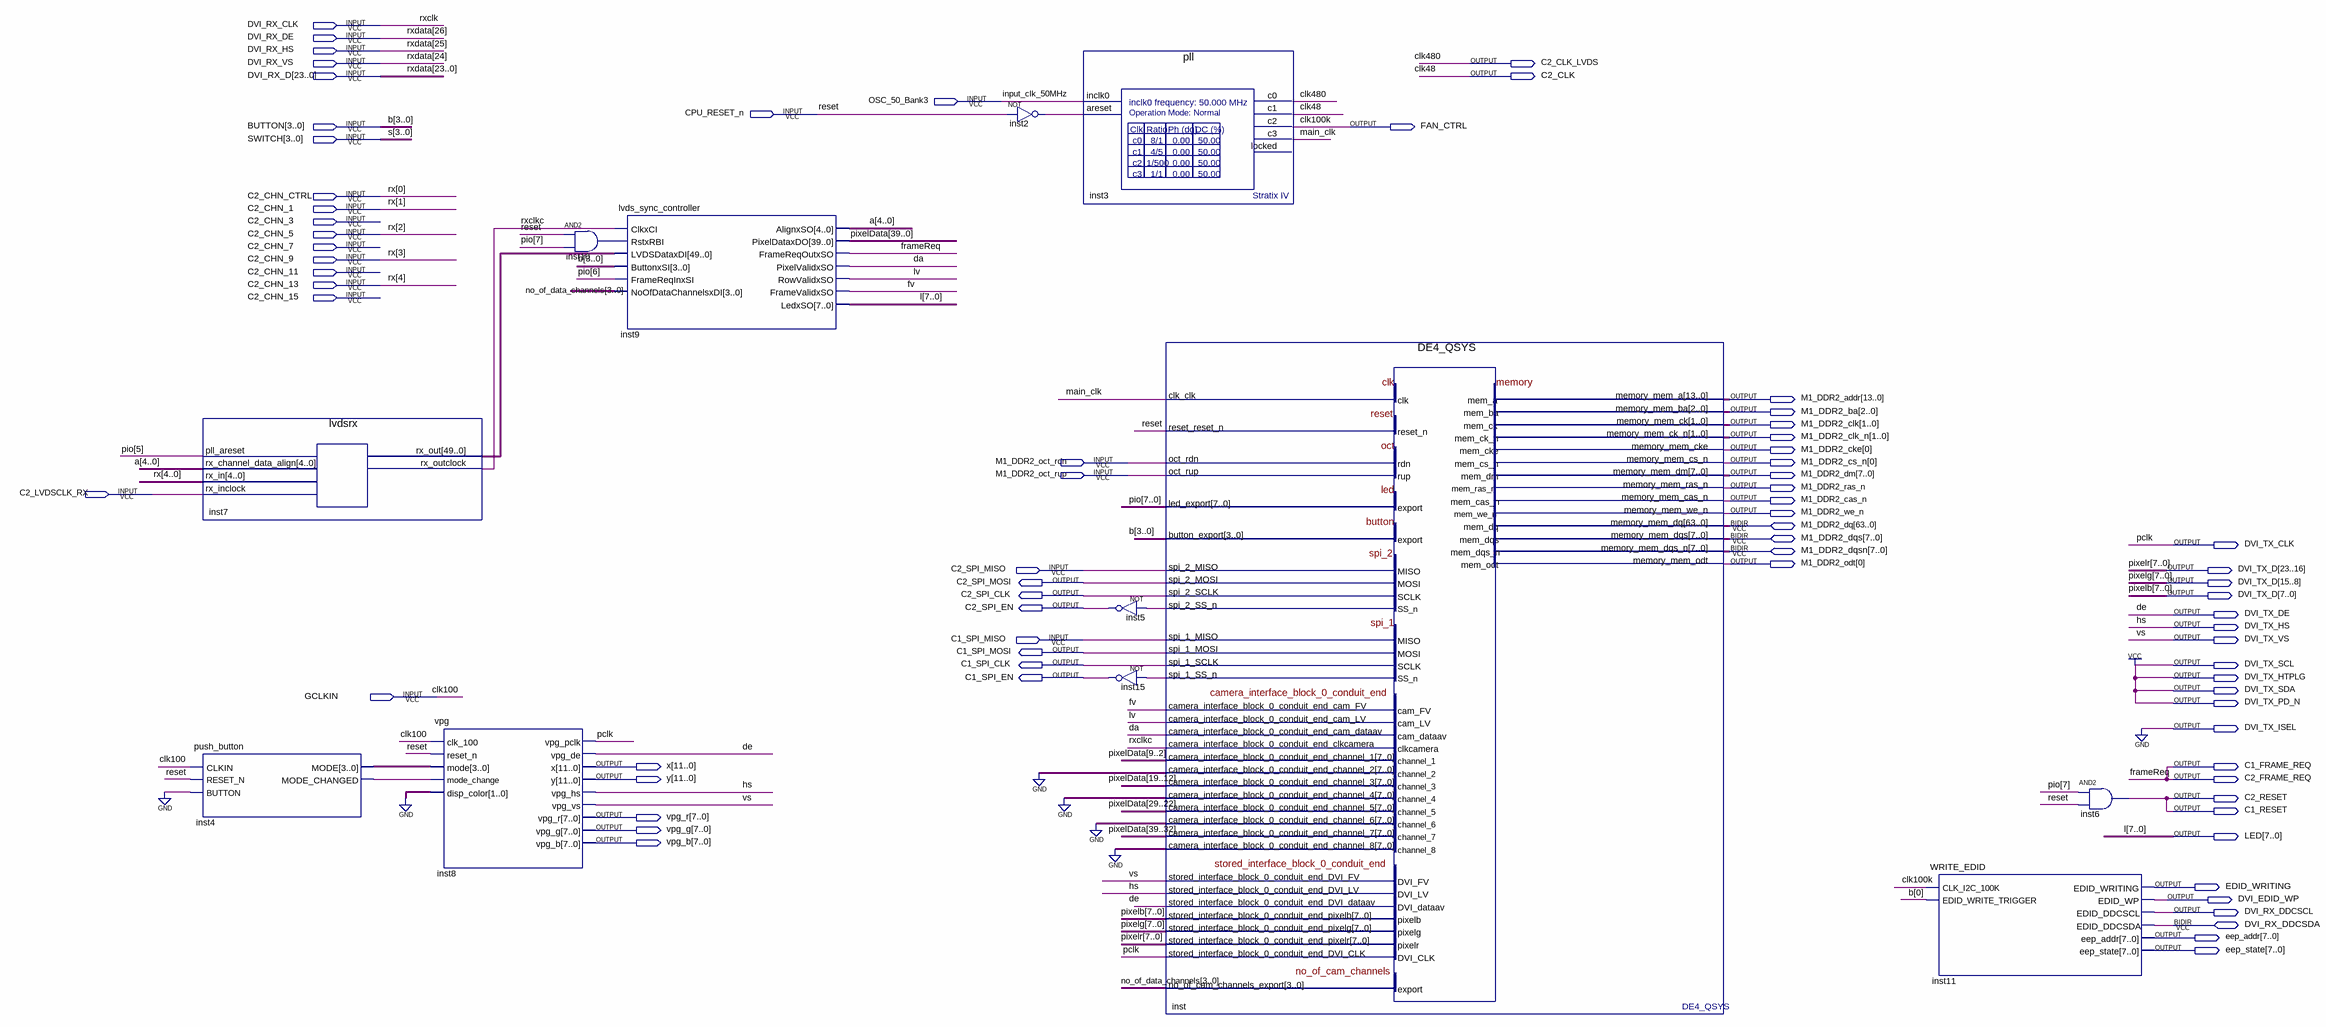
[diagram p0: schematic sheet]
// Quartus schematic cmv4000design.bdf as structural Verilog: 12 symbols, 75 pins
module cmv4000design (
  input  DVI_RX_CLK,
  input  DVI_RX_DE,
  input  DVI_RX_HS,
  input  DVI_RX_VS,
  input  [23:0] DVI_RX_D,
  input  OSC_50_Bank3,
  input  CPU_RESET_n,
  input  [3:0] BUTTON,
  input  [3:0] SWITCH,
  input  C2_CHN_CTRL,
  input  C2_CHN_1,
  input  C2_CHN_3,
  input  C2_CHN_5,
  input  C2_CHN_7,
  input  C2_CHN_9,
  input  C2_CHN_11,
  input  C2_CHN_13,
  input  C2_CHN_15,
  input  M1_DDR2_oct_rdn,
  input  M1_DDR2_oct_rup,
  input  C2_LVDSCLK_RX,
  input  C2_SPI_MISO,
  input  C1_SPI_MISO,
  input  GCLKIN,
  inout  [63:0] M1_DDR2_dq,
  inout  [7:0] M1_DDR2_dqs,
  inout  [7:0] M1_DDR2_dqsn,
  inout  DVI_RX_DDCSDA,
  output C2_CLK_LVDS,
  output C2_CLK,
  output FAN_CTRL,
  output [13:0] M1_DDR2_addr,
  output [2:0] M1_DDR2_ba,
  output [1:0] M1_DDR2_clk,
  output [1:0] M1_DDR2_clk_n,
  output [0:0] M1_DDR2_cke,
  output [0:0] M1_DDR2_cs_n,
  output [7:0] M1_DDR2_dm,
  output M1_DDR2_ras_n,
  output M1_DDR2_cas_n,
  output M1_DDR2_we_n,
  output DVI_TX_CLK,
  output [0:0] M1_DDR2_odt,
  output [23:0] DVI_TX_D,
  output C2_SPI_MOSI,
  output C2_SPI_CLK,
  output C2_SPI_EN,
  output DVI_TX_DE,
  output DVI_TX_HS,
  output DVI_TX_VS,
  output C1_SPI_MOSI,
  output C1_SPI_CLK,
  output DVI_TX_SCL,
  output C1_SPI_EN,
  output DVI_TX_HTPLG,
  output DVI_TX_SDA,
  output DVI_TX_PD_N,
  output DVI_TX_ISEL,
  output [11:0] x,
  output C1_FRAME_REQ,
  output [11:0] y,
  output C2_FRAME_REQ,
  output C2_RESET,
  output C1_RESET,
  output [7:0] vpg_r,
  output [7:0] vpg_g,
  output [7:0] LED,
  output [7:0] vpg_b,
  output EDID_WRITING,
  output DVI_EDID_WP,
  output DVI_RX_DDCSCL,
  output [7:0] eep_addr,
  output [7:0] eep_state
);

  wire da, fv, inst2_out, inst4_mode_changed, inst10_out, inst_spi_1_ss_n, inst_spi_2_ss_n, lv, main_clk,
       rxclkc;
  wire [3:0] inst4_mode, no_of_data_channels;
  wire [4:0] a;
  wire [7:0] pio;
  wire [39:0] pixelData;
  wire [49:0] inst7_rx_out;

  push_button inst4 (
    .CLKIN(GCLKIN), .RESET_N(CPU_RESET_n), .BUTTON(1'b0), .MODE(inst4_mode), .MODE_CHANGED(inst4_mode_changed));
  lvdsrx inst7 (
    .pll_areset(pio[5]), .rx_channel_data_align(a),
    .rx_in({C2_CHN_13, C2_CHN_9, C2_CHN_5, C2_CHN_1, C2_CHN_CTRL}), .rx_inclock(C2_LVDSCLK_RX),
    .rx_out(inst7_rx_out), .rx_outclock(rxclkc));
  vpg inst8 (
    .clk_100(GCLKIN), .reset_n(CPU_RESET_n), .mode(inst4_mode), .mode_change(inst4_mode_changed),
    .disp_color(2'b00), .vpg_pclk(DVI_TX_CLK), .vpg_de(DVI_TX_DE), .x(x), .y(y), .vpg_hs(DVI_TX_HS),
    .vpg_vs(DVI_TX_VS), .vpg_r(vpg_r), .vpg_g(vpg_g), .vpg_b(vpg_b));
  and inst10 (inst10_out, CPU_RESET_n, pio[7]);
  lvds_sync_controller inst9 (
    .ClkxCI(rxclkc), .RstxRBI(inst10_out), .LVDSDataxDI(inst7_rx_out), .ButtonxSI(BUTTON),
    .FrameReqInxSI(pio[6]), .NoOfDataChannelsxDI(no_of_data_channels), .AlignxSO(a),
    .PixelDataxDO(pixelData), .FrameReqOutxSO(C1_FRAME_REQ), .PixelValidxSO(da), .RowValidxSO(lv),
    .FrameValidxSO(fv), .LedxSO(LED));
  not inst2 (inst2_out, CPU_RESET_n);
  pll inst3 (
    .inclk0(OSC_50_Bank3), .areset(inst2_out), .c0(C2_CLK_LVDS), .c1(C2_CLK), .c2(FAN_CTRL), .c3(main_clk));  // open: locked
  not inst5 (C2_SPI_EN, inst_spi_2_ss_n);
  not inst15 (C1_SPI_EN, inst_spi_1_ss_n);
  DE4_QSYS inst (
    .clk_clk(main_clk), .reset_reset_n(CPU_RESET_n), .oct_rdn(M1_DDR2_oct_rdn), .oct_rup(M1_DDR2_oct_rup),
    .button_export(BUTTON), .spi_2_MISO(C2_SPI_MISO), .spi_1_MISO(C1_SPI_MISO),
    .camera_interface_block_0_conduit_end_cam_FV(fv), .camera_interface_block_0_conduit_end_cam_LV(lv),
    .camera_interface_block_0_conduit_end_cam_dataav(da),
    .camera_interface_block_0_conduit_end_clkcamera(rxclkc),
    .camera_interface_block_0_conduit_end_channel_1(pixelData[9:2]),
    .camera_interface_block_0_conduit_end_channel_2({8{1'b0}}),
    .camera_interface_block_0_conduit_end_channel_3(pixelData[19:12]),
    .camera_interface_block_0_conduit_end_channel_4({8{1'b0}}),
    .camera_interface_block_0_conduit_end_channel_5(pixelData[29:22]),
    .camera_interface_block_0_conduit_end_channel_6({8{1'b0}}),
    .camera_interface_block_0_conduit_end_channel_7(pixelData[39:32]),
    .camera_interface_block_0_conduit_end_channel_8({8{1'b0}}),
    .stored_interface_block_0_conduit_end_DVI_FV(DVI_TX_VS),
    .stored_interface_block_0_conduit_end_DVI_LV(DVI_TX_HS),
    .stored_interface_block_0_conduit_end_DVI_dataav(DVI_TX_DE),
    .stored_interface_block_0_conduit_end_DVI_CLK(DVI_TX_CLK), .memory_mem_a(M1_DDR2_addr),
    .memory_mem_ba(M1_DDR2_ba), .memory_mem_ck(M1_DDR2_clk), .memory_mem_ck_n(M1_DDR2_clk_n),
    .memory_mem_cke(M1_DDR2_cke[0]), .memory_mem_cs_n(M1_DDR2_cs_n[0]), .memory_mem_dm(M1_DDR2_dm),
    .memory_mem_ras_n(M1_DDR2_ras_n), .memory_mem_cas_n(M1_DDR2_cas_n), .memory_mem_we_n(M1_DDR2_we_n),
    .memory_mem_odt(M1_DDR2_odt[0]), .led_export(pio), .spi_2_MOSI(C2_SPI_MOSI), .spi_2_SCLK(C2_SPI_CLK),
    .spi_2_SS_n(inst_spi_2_ss_n), .spi_1_MOSI(C1_SPI_MOSI), .spi_1_SCLK(C1_SPI_CLK),
    .spi_1_SS_n(inst_spi_1_ss_n), .stored_interface_block_0_conduit_end_pixelb(DVI_TX_D[7:0]),
    .stored_interface_block_0_conduit_end_pixelg(DVI_TX_D[15:8]),
    .stored_interface_block_0_conduit_end_pixelr(DVI_TX_D[23:16]),
    .no_of_cam_channels_export(no_of_data_channels), .memory_mem_dq(M1_DDR2_dq),
    .memory_mem_dqs(M1_DDR2_dqs), .memory_mem_dqs_n(M1_DDR2_dqsn));
  WRITE_EDID inst11 (
    .CLK_I2C_100K(FAN_CTRL), .EDID_WRITE_TRIGGER(BUTTON[0]), .EDID_WRITING(EDID_WRITING),
    .EDID_WP(DVI_EDID_WP), .eep_addr(eep_addr), .eep_state(eep_state), .EDID_DDCSCL(DVI_RX_DDCSCL),
    .EDID_DDCSDA(DVI_RX_DDCSDA));
  and inst6 (C1_RESET, pio[7], CPU_RESET_n);

  assign C2_FRAME_REQ = C1_FRAME_REQ;
  assign C2_RESET = C1_RESET;
  assign DVI_TX_HTPLG = 1'b1;
  assign DVI_TX_ISEL = 1'b0;
  assign DVI_TX_PD_N = 1'b1;
  assign DVI_TX_SCL = 1'b1;
  assign DVI_TX_SDA = 1'b1;

  // Other names for the same wires on the sheet: b[3:0] = BUTTON; frameReq = C1_FRAME_REQ; clk48 = C2_CLK;
  //   clk100 = GCLKIN; clk100k = FAN_CTRL; clk480 = C2_CLK_LVDS; de = DVI_TX_DE; hs = DVI_TX_HS;
  //   input_clk_50MHz = OSC_50_Bank3; l[7:0] = LED; pclk = DVI_TX_CLK; pixelb[7:0] = DVI_TX_D[7:0];
  //   pixelg[7:0] = DVI_TX_D[15:8]; pixelr[7:0] = DVI_TX_D[23:16]; reset = CPU_RESET_n;
  //   rx[4:0] = {C2_CHN_13, C2_CHN_9, C2_CHN_5, C2_CHN_1, C2_CHN_CTRL}; rxclk = DVI_RX_CLK;
  //   rxdata[26:0] = {DVI_RX_DE, DVI_RX_HS, DVI_RX_VS, DVI_RX_D}; s[3:0] = SWITCH; vs = DVI_TX_VS
endmodule
